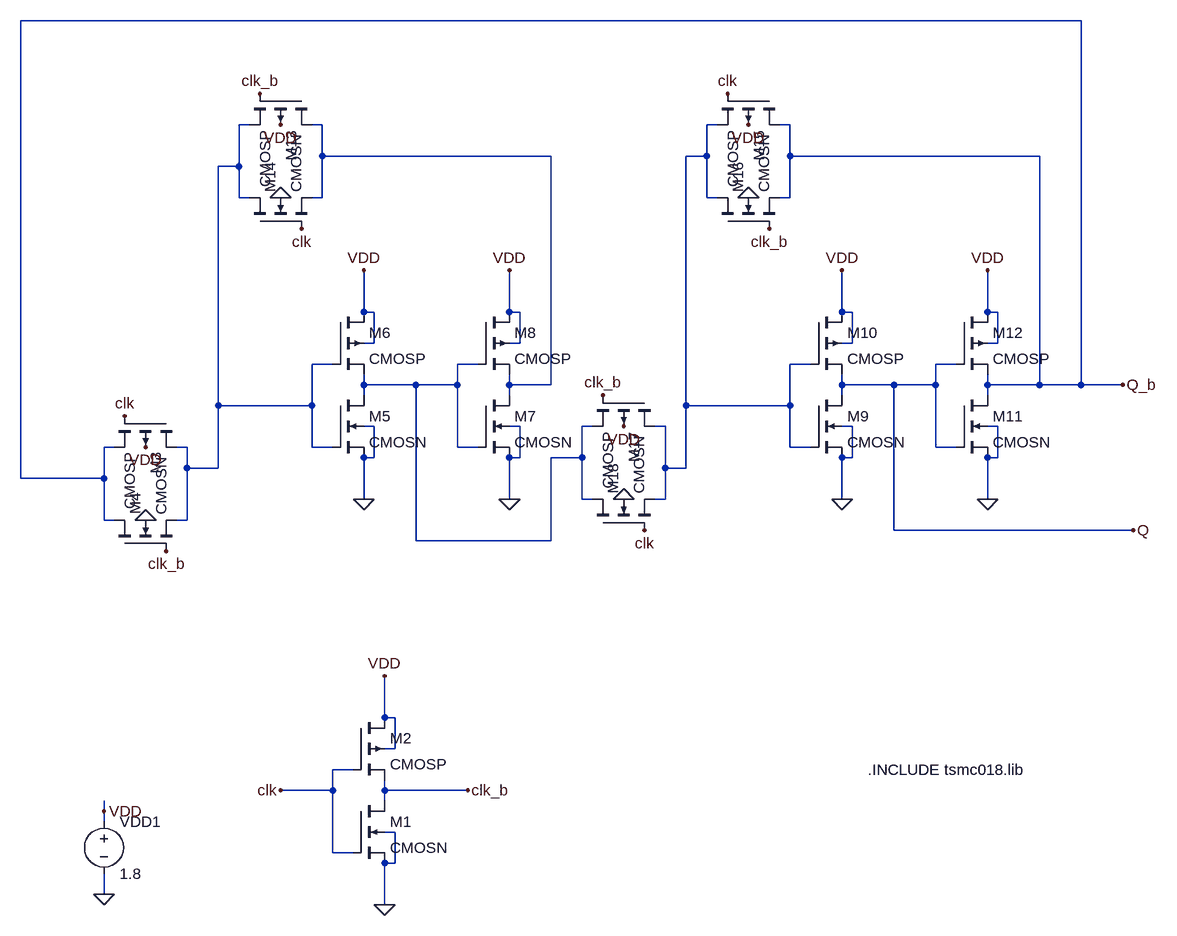
[diagram p0: schematic f_div.asc]
f_div.asc, the LTspice schematic file:
Version 4
SHEET 1 1840 680
WIRE 1712 -1024 80 -1024
WIRE 432 -864 416 -864
WIRE 544 -864 528 -864
WIRE 1152 -864 1136 -864
WIRE 1264 -864 1248 -864
WIRE 544 -816 544 -864
WIRE 896 -816 544 -816
WIRE 1136 -816 1136 -864
WIRE 1136 -816 1104 -816
WIRE 1264 -816 1264 -864
WIRE 1648 -816 1264 -816
WIRE 416 -800 416 -864
WIRE 416 -800 384 -800
WIRE 416 -752 416 -800
WIRE 432 -752 416 -752
WIRE 544 -752 544 -816
WIRE 544 -752 528 -752
WIRE 1136 -752 1136 -816
WIRE 1152 -752 1136 -752
WIRE 1264 -752 1264 -816
WIRE 1264 -752 1248 -752
WIRE 608 -576 608 -640
WIRE 624 -576 608 -576
WIRE 832 -576 832 -640
WIRE 848 -576 832 -576
WIRE 1344 -576 1344 -640
WIRE 1360 -576 1344 -576
WIRE 1568 -576 1568 -640
WIRE 1584 -576 1568 -576
WIRE 624 -528 624 -576
WIRE 624 -528 608 -528
WIRE 848 -528 848 -576
WIRE 848 -528 832 -528
WIRE 1360 -528 1360 -576
WIRE 1360 -528 1344 -528
WIRE 1584 -528 1584 -576
WIRE 1584 -528 1568 -528
WIRE 560 -496 528 -496
WIRE 784 -496 752 -496
WIRE 1296 -496 1264 -496
WIRE 1520 -496 1488 -496
WIRE 608 -464 608 -480
WIRE 688 -464 608 -464
WIRE 752 -464 752 -496
WIRE 752 -464 688 -464
WIRE 832 -464 832 -480
WIRE 896 -464 896 -816
WIRE 896 -464 832 -464
WIRE 1344 -464 1344 -480
WIRE 1424 -464 1344 -464
WIRE 1488 -464 1488 -496
WIRE 1488 -464 1424 -464
WIRE 1568 -464 1568 -480
WIRE 1648 -464 1648 -816
WIRE 1648 -464 1568 -464
WIRE 1712 -464 1712 -1024
WIRE 1712 -464 1648 -464
WIRE 1776 -464 1712 -464
WIRE 608 -448 608 -464
WIRE 832 -448 832 -464
WIRE 1344 -448 1344 -464
WIRE 1568 -448 1568 -464
WIRE 384 -432 384 -800
WIRE 528 -432 528 -496
WIRE 528 -432 384 -432
WIRE 1104 -432 1104 -816
WIRE 1264 -432 1264 -496
WIRE 1264 -432 1104 -432
WIRE 624 -400 608 -400
WIRE 848 -400 832 -400
WIRE 960 -400 944 -400
WIRE 1072 -400 1056 -400
WIRE 1360 -400 1344 -400
WIRE 1584 -400 1568 -400
WIRE 224 -368 208 -368
WIRE 336 -368 320 -368
WIRE 528 -368 528 -432
WIRE 560 -368 528 -368
WIRE 752 -368 752 -464
WIRE 784 -368 752 -368
WIRE 1264 -368 1264 -432
WIRE 1296 -368 1264 -368
WIRE 1488 -368 1488 -464
WIRE 1520 -368 1488 -368
WIRE 624 -352 624 -400
WIRE 624 -352 608 -352
WIRE 848 -352 848 -400
WIRE 848 -352 832 -352
WIRE 944 -352 944 -400
WIRE 944 -352 896 -352
WIRE 1360 -352 1360 -400
WIRE 1360 -352 1344 -352
WIRE 1584 -352 1584 -400
WIRE 1584 -352 1568 -352
WIRE 336 -336 336 -368
WIRE 384 -336 384 -432
WIRE 384 -336 336 -336
WIRE 1072 -336 1072 -400
WIRE 1104 -336 1104 -432
WIRE 1104 -336 1072 -336
WIRE 80 -320 80 -1024
WIRE 208 -320 208 -368
WIRE 208 -320 80 -320
WIRE 608 -288 608 -352
WIRE 832 -288 832 -352
WIRE 944 -288 944 -352
WIRE 960 -288 944 -288
WIRE 1072 -288 1072 -336
WIRE 1072 -288 1056 -288
WIRE 1344 -288 1344 -352
WIRE 1568 -288 1568 -352
WIRE 208 -256 208 -320
WIRE 224 -256 208 -256
WIRE 336 -256 336 -336
WIRE 336 -256 320 -256
WIRE 1424 -240 1424 -464
WIRE 1792 -240 1424 -240
WIRE 688 -224 688 -464
WIRE 896 -224 896 -352
WIRE 896 -224 688 -224
WIRE 640 48 640 -16
WIRE 656 48 640 48
WIRE 656 96 656 48
WIRE 656 96 640 96
WIRE 592 128 560 128
WIRE 560 160 560 128
WIRE 560 160 480 160
WIRE 640 160 640 144
WIRE 768 160 640 160
WIRE 640 176 640 160
WIRE 208 192 208 176
WIRE 208 208 208 192
WIRE 656 224 640 224
WIRE 560 256 560 160
WIRE 592 256 560 256
WIRE 656 272 656 224
WIRE 656 272 640 272
WIRE 208 320 208 288
WIRE 640 336 640 272
FLAG 208 320 0
FLAG 208 192 VDD
FLAG 480 160 clk
FLAG 768 160 clk_b
FLAG 640 -16 VDD
FLAG 640 336 0
FLAG 272 -368 VDD
FLAG 272 -256 0
FLAG 304 -208 clk_b
FLAG 240 -416 clk
FLAG 608 -640 VDD
FLAG 608 -288 0
FLAG 832 -640 VDD
FLAG 832 -288 0
FLAG 1344 -640 VDD
FLAG 1344 -288 0
FLAG 1568 -640 VDD
FLAG 1568 -288 0
FLAG 480 -864 VDD
FLAG 480 -752 0
FLAG 512 -704 clk
FLAG 448 -912 clk_b
FLAG 1200 -864 VDD
FLAG 1200 -752 0
FLAG 1232 -704 clk_b
FLAG 1168 -912 clk
FLAG 1008 -400 VDD
FLAG 1008 -288 0
FLAG 1040 -240 clk
FLAG 976 -448 clk_b
FLAG 1776 -464 Q_b
FLAG 1792 -240 Q
SYMBOL voltage 208 192 R0
WINDOW 123 0 0 Left 2
WINDOW 39 0 0 Left 2
SYMATTR InstName VDD1
SYMATTR Value 1.8
SYMBOL cmosn 592 176 R0
SYMATTR InstName M1
SYMATTR Value2 l=180n w=180n
SYMBOL cmosp 592 48 R0
SYMATTR InstName M2
SYMATTR Value2 l=180n w=540n
SYMBOL cmosp 320 -416 R90
SYMATTR InstName M3
SYMATTR Value2 l=180n w=540n
SYMBOL cmosn 224 -208 R270
SYMATTR InstName M4
SYMATTR Value2 l=180n w=180n
SYMBOL cmosn 560 -448 R0
SYMATTR InstName M5
SYMATTR Value2 l=180n w=180n
SYMBOL cmosp 560 -576 R0
SYMATTR InstName M6
SYMATTR Value2 l=180n w=540n
SYMBOL cmosn 784 -448 R0
SYMATTR InstName M7
SYMATTR Value2 l=180n w=180n
SYMBOL cmosp 784 -576 R0
SYMATTR InstName M8
SYMATTR Value2 l=180n w=540n
SYMBOL cmosn 1296 -448 R0
SYMATTR InstName M9
SYMATTR Value2 l=180n w=180n
SYMBOL cmosp 1296 -576 R0
SYMATTR InstName M10
SYMATTR Value2 l=180n w=540n
SYMBOL cmosn 1520 -448 R0
SYMATTR InstName M11
SYMATTR Value2 l=180n w=180n
SYMBOL cmosp 1520 -576 R0
SYMATTR InstName M12
SYMATTR Value2 l=180n w=540n
SYMBOL cmosp 528 -912 R90
SYMATTR InstName M13
SYMATTR Value2 l=180n w=540n
SYMBOL cmosn 432 -704 R270
SYMATTR InstName M14
SYMATTR Value2 l=180n w=180n
SYMBOL cmosp 1248 -912 R90
SYMATTR InstName M15
SYMATTR Value2 l=180n w=540n
SYMBOL cmosn 1152 -704 R270
SYMATTR InstName M16
SYMATTR Value2 l=180n w=180n
SYMBOL cmosp 1056 -448 R90
SYMATTR InstName M17
SYMATTR Value2 l=180n w=540n
SYMBOL cmosn 960 -240 R270
SYMATTR InstName M18
SYMATTR Value2 l=180n w=180n
TEXT 1384 128 Left 2 !.INCLUDE tsmc018.lib

The netlist it stands for:
* f_div.asc
VDD1 VDD 0 1.8
M1 clk_b clk 0 0 CMOSN l=180n w=180n
M2 VDD clk clk_b VDD CMOSP l=180n w=540n
M3 N001 clk Q_b VDD CMOSP l=180n w=540n
M4 Q_b clk_b N001 0 CMOSN l=180n w=180n
M5 N004 N001 0 0 CMOSN l=180n w=180n
M6 VDD N001 N004 VDD CMOSP l=180n w=540n
M7 N002 N004 0 0 CMOSN l=180n w=180n
M8 VDD N004 N002 VDD CMOSP l=180n w=540n
M9 Q N003 0 0 CMOSN l=180n w=180n
M10 VDD N003 Q VDD CMOSP l=180n w=540n
M11 Q_b Q 0 0 CMOSN l=180n w=180n
M12 VDD Q Q_b VDD CMOSP l=180n w=540n
M13 N002 clk_b N001 VDD CMOSP l=180n w=540n
M14 N001 clk N002 0 CMOSN l=180n w=180n
M15 Q_b clk N003 VDD CMOSP l=180n w=540n
M16 N003 clk_b Q_b 0 CMOSN l=180n w=180n
M17 N003 clk_b N004 VDD CMOSP l=180n w=540n
M18 N004 clk N003 0 CMOSN l=180n w=180n
.model NMOS NMOS
.model PMOS PMOS
.lib standard.mos
.INCLUDE tsmc018.lib
.backanno
.end